# EAGLE design HeadMouse_small (EAGLE 9.4.2)
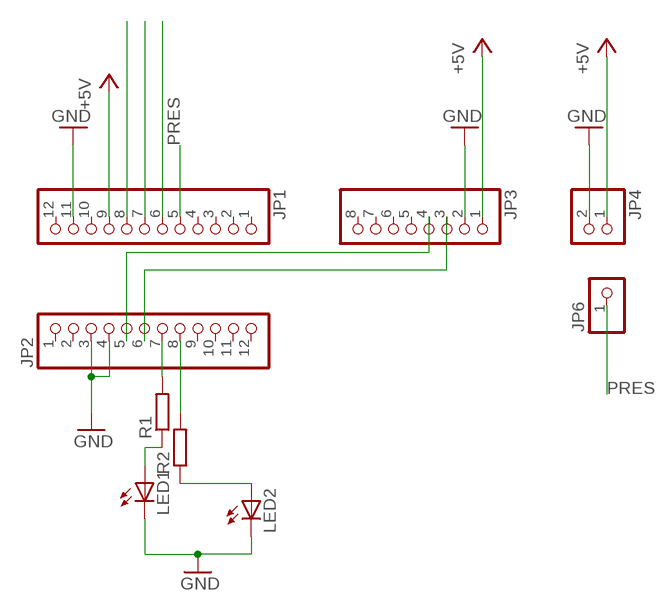
[diagram p0: schematic, sheet 1]

## Parts
JP1  PINHD-1X12  [1X12]
JP2  PINHD-1X12  [1X12]
JP3  PINHD-1X8BIG  [1X08-BIG]
JP4  PINHD-1X2  [1X02]
JP6  PINHD-1X1  [1X01]
LED1  LED3MM  [LED3MM]
LED2  LED3MM  [LED3MM]
R1  R-EU_0204/7  [0204/7]
R2  R-EU_0204/7  [0204/7]

## Nets
+5V: JP1.9 JP3.1 JP4.1
GND: JP1.11 JP2.3 JP2.4 JP3.2 JP4.2 LED1.K(C) LED2.K(C)
N$1: JP2.5 JP3.4
N$2: JP2.8 R2.2
N$3: LED1.A R1.1
N$4: LED2.A R2.1
N$5: JP2.7 R1.2
N$6: JP2.6 JP3.3
N$7: JP1.8
N$8: JP1.7
N$9: JP1.6
PRES: JP1.5 JP6.1
Unconnected: JP1.1 JP1.2 JP1.3 JP1.4 JP1.10 JP1.12 JP2.1 JP2.2 JP2.9 JP2.10 JP2.11 JP2.12 JP3.5 JP3.6 JP3.7 JP3.8

## Library data of the parts
JP1 JP2 = adafruit:PINHD-1X12: PIN HEADER
JP3 = adafruit:PINHD-1X8: PIN HEADER
JP4 = pinhead:PINHD-1X2: PIN HEADER
JP6 = pinhead:PINHD-1X1: PIN HEADER
LED1 LED2 = adafruit:LED: LED OSRAM: - CHIPLED LG R971, LG N971, LY N971, LG Q971, LY Q971, LO R971, LY R971 LH N974, LH R974 LS Q976, LO Q976, LY Q976 LO Q996 - Hyper CHIPLED LW Q18S LB Q993, LB Q99A, LB R99A - SideLED LS A670, LO A670, LY A670, LG A670, LP A670 LB A673, LV A673, LT A673, LW A673 LH A674 LY A675 LS A676, LA A676, LO A676, LY A676, LW A676 LS A679, LY A679, LG A679 - Hyper Micro SIDELED® LS Y876, LA Y876, LO Y876, LY Y876 LT Y87S - SmartLED LW L88C, LW L88S LB L89C, LB L89S, LG L890 LS L89K, LO L89K, LY L89K LS L896, LA L896, LO L896, LY L896 - TOPLED LS T670, LO T670, LY T670, LG T670, LP T670 LSG T670, LSP T670, LSY T670, LOP T670, LYG T670 LG T671, LOG T671, LSG T671 LB T673, LV T673, LT T673, LW T673 LH T674 LS T676, LA T676, LO T676, LY T676, LB T676, LH T676, LSB T676, LW T676 LB T67C, LV T67C, LT T67C, LS T67K, LO T67K, LY T67K, LW E67C LS E67B, LA E67B, LO E67B, LY E67B, LB E67C, LV E67C, LT E67C LW T67C LS T679, LY T679, LG T679 LS T770, LO T770, LY T770, LG T770, LP T770 LB T773, LV T773, LT T773, LW T773 LH T774 LS E675, LA E675, LY E675, LS T675 LS T776, LA T776, LO T776, LY T776, LB T776 LHGB T686 LT T68C, LB T68C - Hyper Mini TOPLED® LB M676 - Mini TOPLED Santana® LG M470 LS M47K, LO M47K, LY M47K Source: http://www.osram.convergy.de/
R1 R2 = rcl:R-EU_: RESISTOR, European symbol; SPICEPREFIX: R

## Board
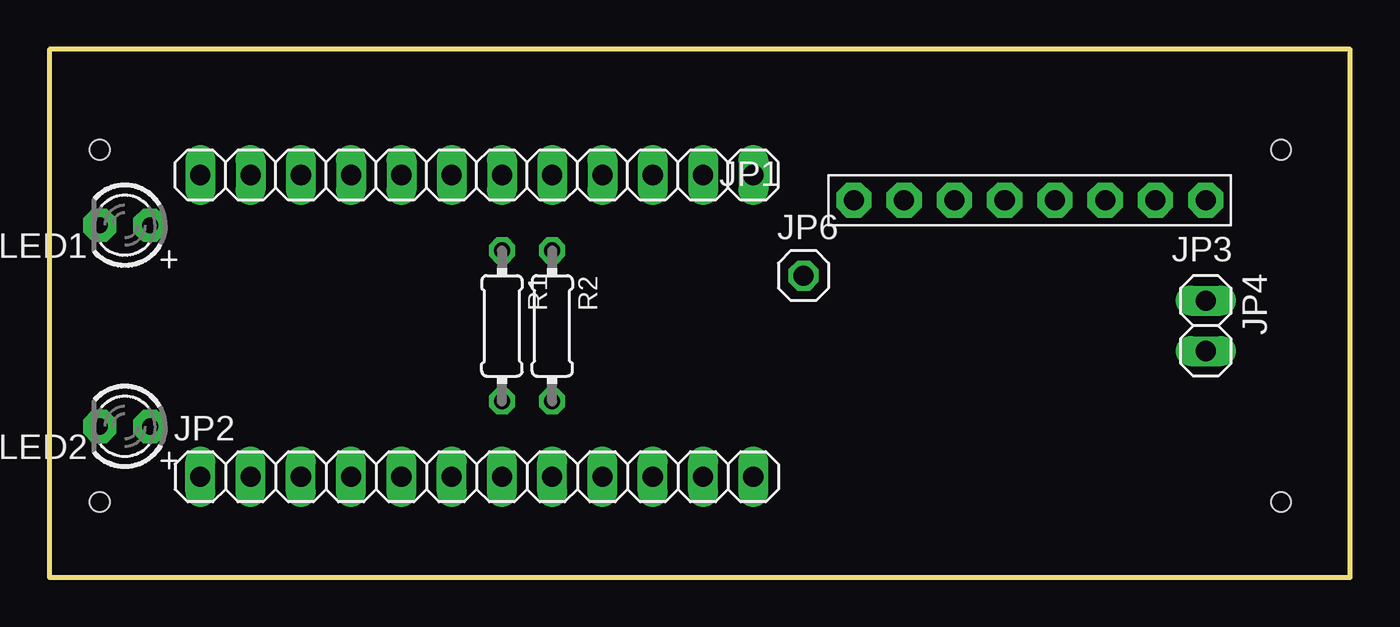
[diagram p1: board, top side]
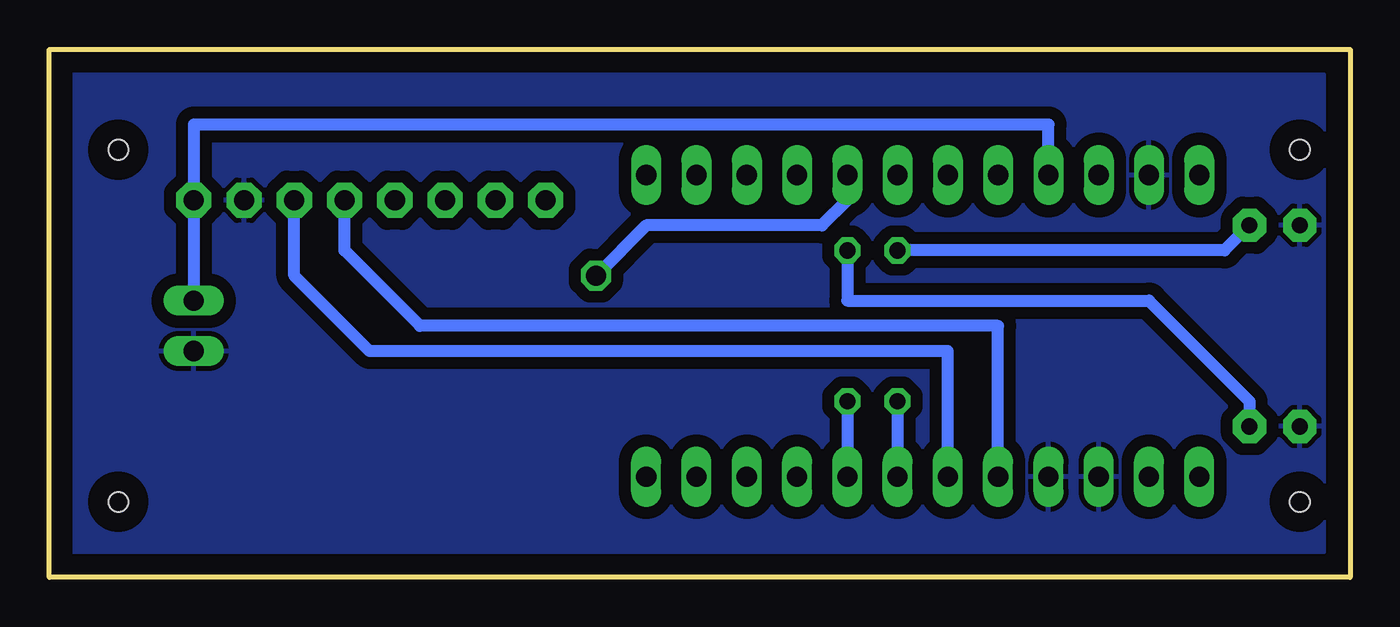
[diagram p2: board, bottom side, seen from below]

Size 65.71 x 26.66 mm. Coordinates in mm from the lower left corner, seen from the top.
Outline: 0,0 65.71,0 65.71,26.66 0,26.66 0,0
Copper layers (1*16): Top 0.035mm / dielectric 1.5mm / Bottom 0.035mm
Design rules "default": minimum track width 6mil, minimum drill 0.35mm, track to track 6mil, track to pad 6mil, pad to pad 6mil, via to via 6mil, smd to smd 6mil, copper to edge 40mil, drill to drill 6mil, minimum pad ring 10mil, minimum via ring 8mil, stop-mask expansion 4mil, vias tented up to drill 0mil, thermal gap 10mil
Holes 1 mm at 62.23,21.59 62.23,3.81 2.54,21.59 2.54,3.81

### Footprints (pad centres in the part's own frame; a part is rotated, then mirrored left to right if it is on the bottom)
1X12 = drill 1.016 long: 1 -13.97,0; 2 -11.43,0; 3 -8.89,0; 4 -6.35,0; 5 -3.81,0; 6 -1.27,0; 7 1.27,0; 8 3.81,0; 9 6.35,0; 10 8.89,0; 11 11.43,0; 12 13.97,0
1X08-BIG = drill 1.016 pad 1.778 octagon: 1 -8.89,0; 2 -6.35,0; 3 -3.81,0; 4 -1.27,0; 5 1.27,0; 6 3.81,0; 7 6.35,0; 8 8.89,0
1X02 = drill 1.016 long: 1 -1.27,0; 2 1.27,0
1X01 = drill 1.016 octagon: 1 0,0
LED3MM = drill 0.813 pad 1.676 octagon: A -1.27,0; K 1.27,0
0204/7 = drill 0.813 octagon: 1 -3.81,0; 2 3.81,0

### Placement (x,y rotation side)
JP1  21.59,20.32 180 top
JP2  21.59,5.08 0 top
JP3  49.53,19.05 180 top
JP4  58.42,12.7 270 top
JP6  38.1,15.24 0 top
LED1  3.81,17.78 180 top
LED2  3.81,7.62 180 top
R1  22.86,12.7 270 top
R2  25.4,12.7 270 top

### Tracks (layer width: path | path; a pad name or v marks a point on that pad's centre or on a via)
+5V
  Bottom 0.61: JP1.9 15.24,22.86 58.42,22.86 JP3.1 JP4.1
GND
  pour Bottom (isolate 0.61): 1.27,25.4 64.77,25.4 64.77,1.27 1.27,1.27
N$1
  Bottom 0.61: JP2.5 17.78,12.7 46.99,12.7 50.8,16.51 JP3.4
N$2
  Bottom 0.61: R2.2 JP2.8
N$3
  Bottom 0.61: LED1.A 6.35,16.51 R1.1
N$4
  Bottom 0.61: R2.1 25.4,13.97 10.16,13.97 5.08,8.89 LED2.A
N$5
  Bottom 0.61: R1.2 JP2.7
N$6
  Bottom 0.61: JP2.6 20.32,11.43 49.53,11.43 53.34,15.24 JP3.3
PRES
  Bottom 0.61: JP1.5 25.4,19.05 26.67,17.78 35.56,17.78 JP6.1